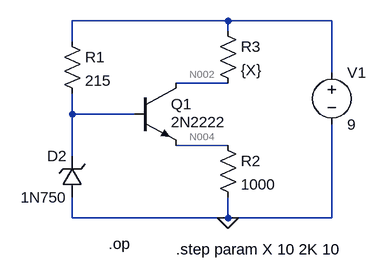
[diagram p0: schematic Prelab2.asc]
Prelab2.asc, the LTspice schematic file:
Version 4
SHEET 1 880 680
WIRE 144 32 -96 32
WIRE 304 32 144 32
WIRE 144 48 144 32
WIRE -96 64 -96 32
WIRE 304 112 304 32
WIRE 144 128 64 128
WIRE -96 176 -96 144
WIRE 0 176 -96 176
WIRE 144 224 64 224
WIRE -96 240 -96 176
WIRE -96 336 -96 304
WIRE 144 336 144 304
WIRE 144 336 -96 336
WIRE 304 336 304 192
WIRE 304 336 144 336
FLAG 144 336 0
SYMBOL res -112 48 R0
SYMATTR InstName R1
SYMATTR Value 215
SYMBOL res 128 208 R0
SYMATTR InstName R2
SYMATTR Value 1000
SYMBOL res 128 32 R0
SYMATTR InstName R3
SYMATTR Value {X}
SYMBOL voltage 304 96 R0
WINDOW 123 0 0 Left 0
WINDOW 39 0 0 Left 0
SYMATTR InstName V1
SYMATTR Value 9
SYMBOL zener -80 304 R180
WINDOW 0 24 64 Left 2
WINDOW 3 24 0 Left 2
SYMATTR InstName D2
SYMATTR Value 1N750
SYMATTR Description Diode
SYMATTR Type diode
SYMBOL npn 0 128 R0
WINDOW 3 56 60 Left 2
SYMATTR InstName Q1
SYMATTR Value 2N2222
TEXT 64 384 Left 2 !.step param X 10 2K 10
TEXT -40 376 Left 2 !.op

The netlist it stands for:
* Prelab2.asc
R1 N001 N003 215
R2 N004 0 1000
R3 N001 N002 {X}
V1 N001 0 9
D2 0 N003 1N750
Q1 N002 N003 N004 0 2N2222
.model D D
.lib standard.dio
.model NPN NPN
.model PNP PNP
.lib standard.bjt
.step param X 10 2K 10
.op
.backanno
.end

* Results of the author's LTspice run, read from the files saved beside the schematic
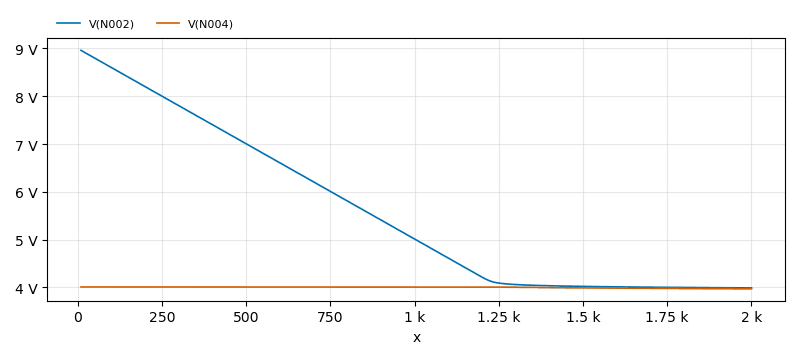
[diagram p1: Operating Point of Prelab2.asc, plotted from the saved traces]
* Operating Point, 1 run:
*   V(N002): 8.96 V at x=10 , 3.989 V at x=2 k, min 3.989 V, max 8.96 V
*   V(N004): 4.009 V at x=10 , 3.971 V at x=2 k, min 3.971 V, max 4.009 V
* From the log:
*   Semiconductor Device Operating Points:
*                           --- Diodes ---
*   Name:      d2
*   Model:    1n750
*   Id:     -2.00e-02
*   Vd:     -4.70e+00
*   Req:     2.41e+00
*   CAP:     5.88e-11
*                           --- Bipolar Transistors ---
*   Name:       q1
*   Model:    2n2222
*   Ib:       1.94e-05
*   Ic:       3.99e-03
*   Vbe:      6.91e-01
*   Vbc:     -4.26e+00
*   Vce:      4.95e+00
*   BetaDC:   2.06e+02
*   Gm:       1.52e-01
*   Rpi:      1.33e+03
*   Rx:       1.00e+01
*   Ro:       2.61e+04
*   Cbe:      1.01e-10
*   Cbc:      4.28e-12
*   Cjs:      0.00e+00
*   BetaAC:   2.03e+02
*   Cbx:      0.00e+00
*   Ft:       2.30e+08